# Altium project AMC_FMC_Carrier v4.PrjPcb (part 2 of 17)

## Sheet FPGA.SchDoc: AMC FMC Carrier v4
size 420 x 297 mm; Organization: WUT ISE; Address1: Warsaw University of Technology; Address2: Nowowiejska 15/19 00-665 Warsaw; Address3: t.przywozki@gmail.com; DocumentNumber: 1; SheetNumber: 3; SheetTotal: 29; ModifiedBy: M. Biernat; CheckedDate: -; Title2: FPGA Artix-7; DivGrp: ISE; Designer: T.Przywozki; Project: AMC FMC Carrier v4.0.2
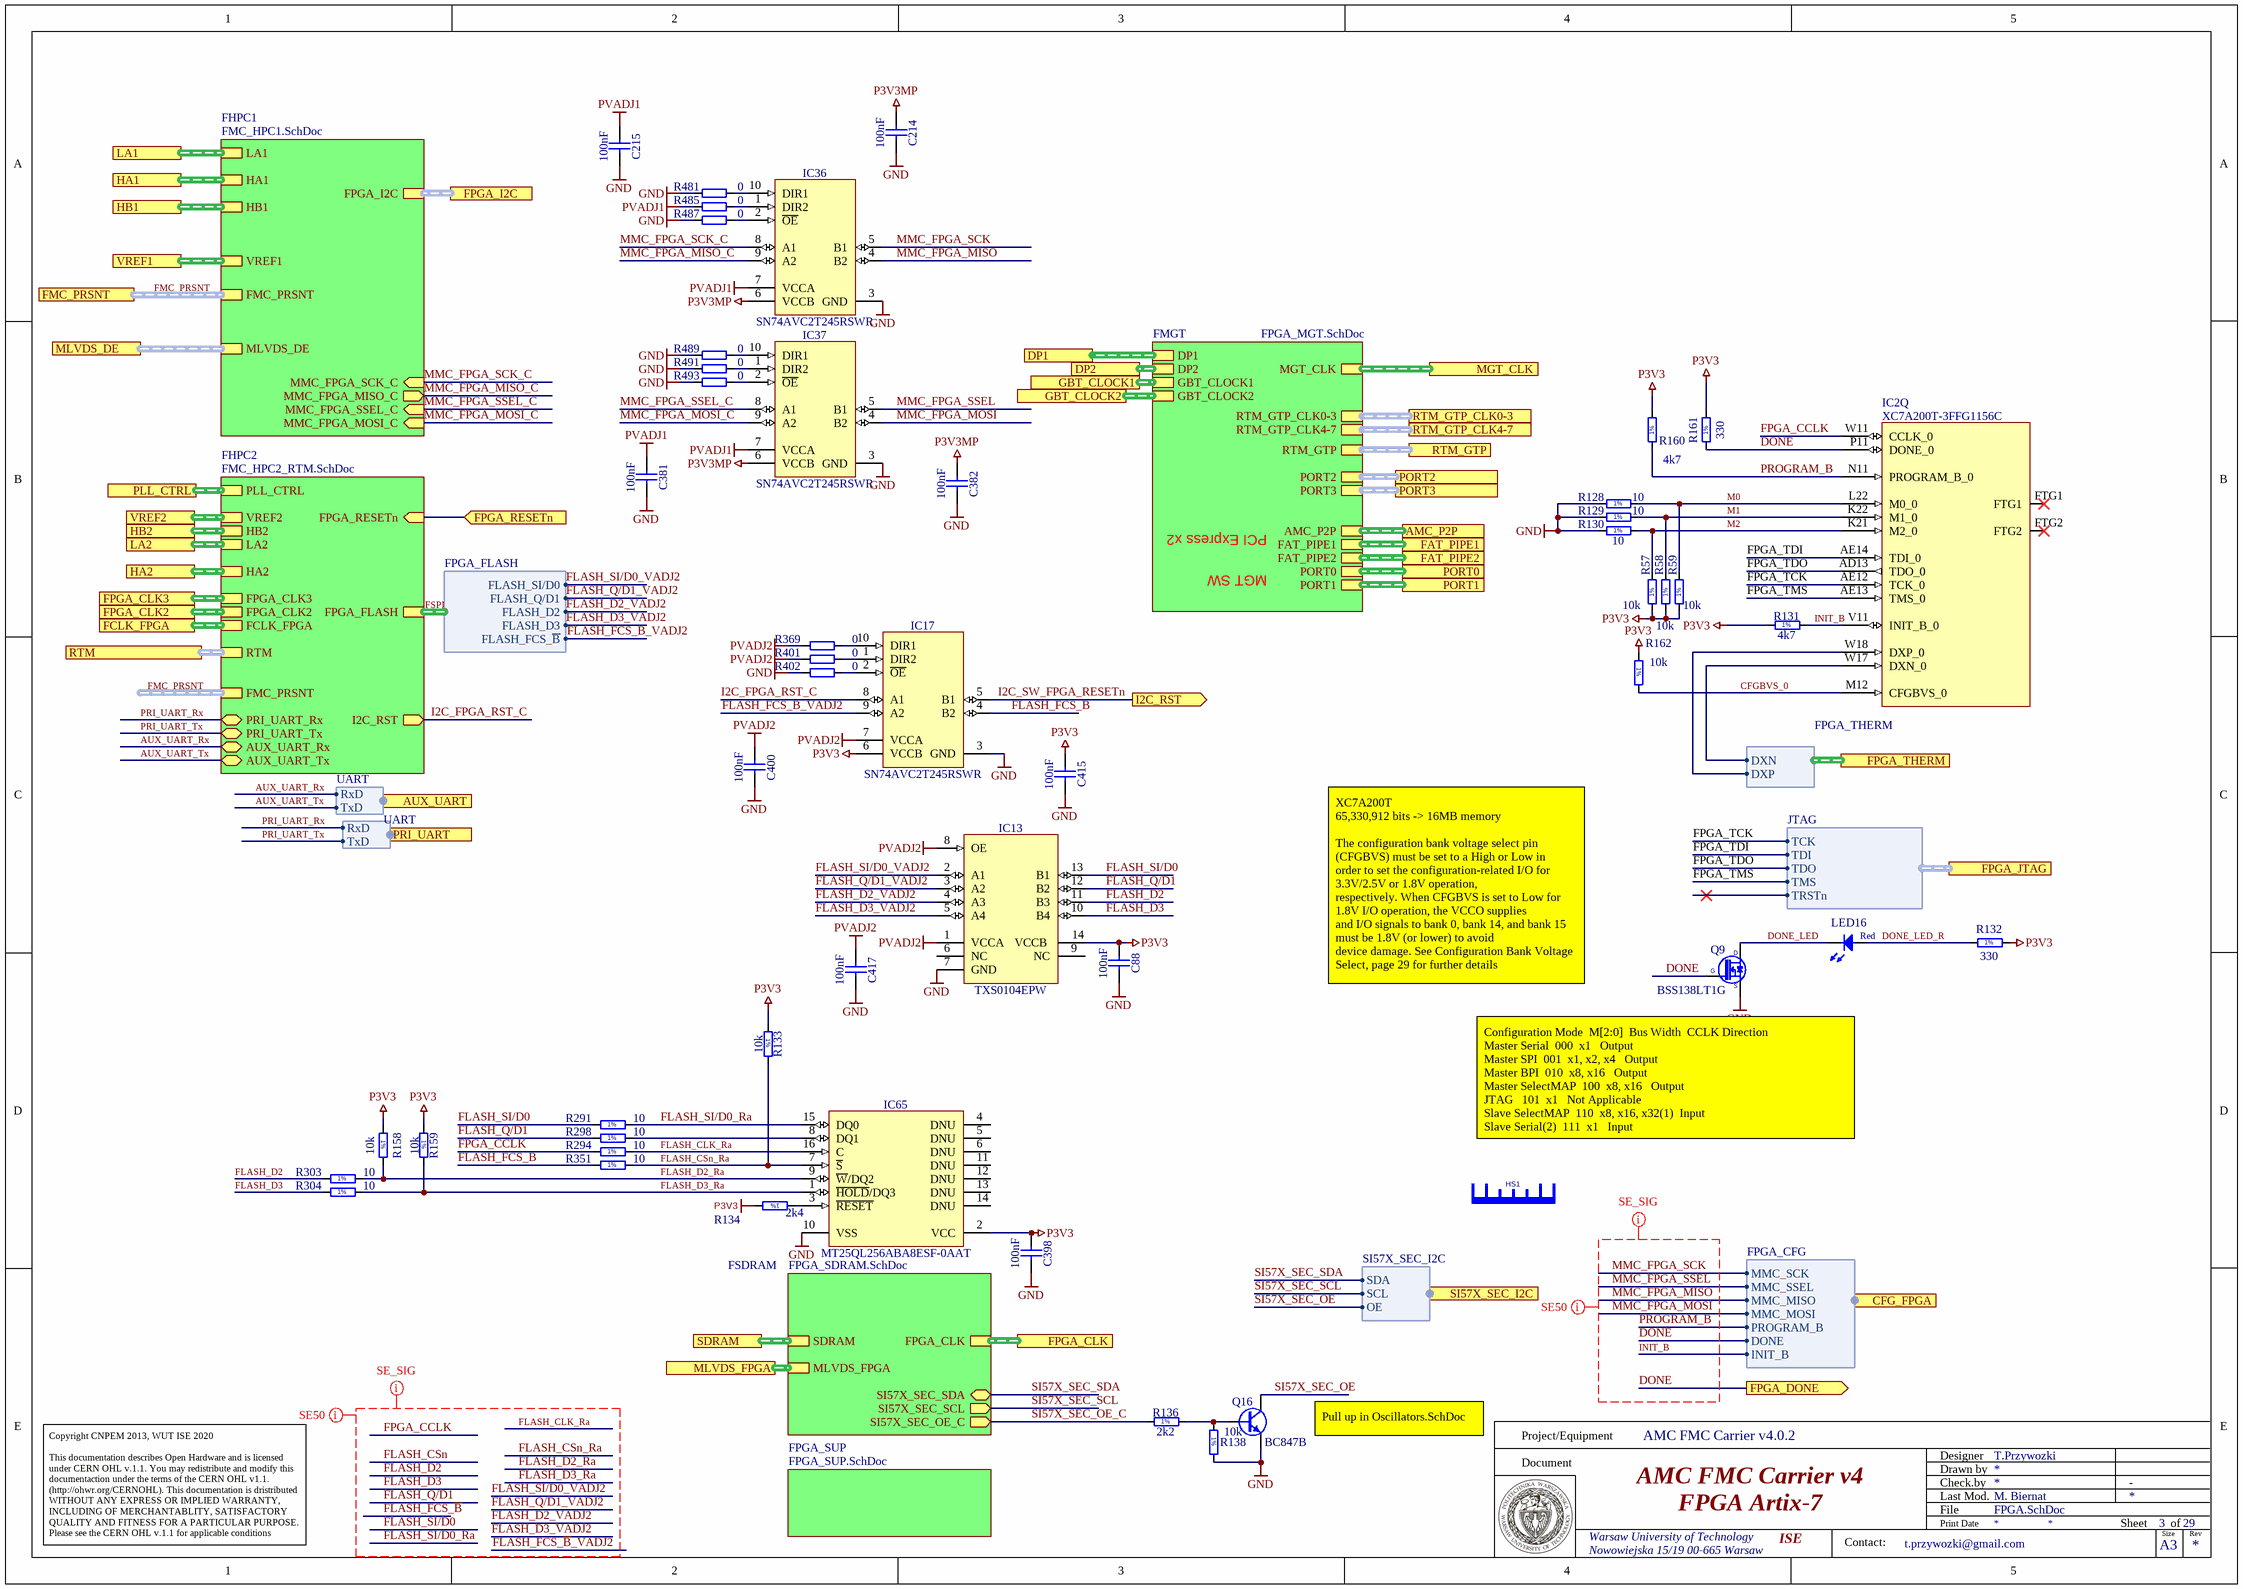
[diagram p3: FPGA.SchDoc]

### Parts
C88  100nF  [CAPC0603X33N]
C214  100nF  [CAPC0603X33N]
C215  100nF  [CAPC0603X33N]
C381  100nF  [CAPC0603X33N]
C382  100nF  [CAPC0603X33N]
C398  100nF  [CAPC0603X33N]
C400  100nF  [CAPC0603X33N]
C415  100nF  [CAPC0603X33N]
C417  100nF  [CAPC0603X33N]
HS1  Heat Sink No Pad  [HSINK_ATS_ATS-50350B-C1-R0]  (value not drawn)
IC2  XC7A200T-3FFG1156C  [BGA1156C100P34X34_3500X3500X335]  (part Q of 23)
IC13  TXS0104EPW  [SOP65P640X120-14N]
IC17  SN74AVC2T245RSWR  [QFN40P140X180X55-10N]
IC36  SN74AVC2T245RSWR  [QFN40P140X180X55-10N]
IC37  SN74AVC2T245RSWR  [QFN40P140X180X55-10N]
IC65  MT25QL256ABA8ESF-0AAT  [SOIC127P1030X265-16N]
LED16  Red  [LED_KINGBRIGHT_KPH-1608SURCK]
Q9  BSS138LT1G  [SOT95P240X110-3N]
Q16  BC847B  [SOT95P230X110-3N]
R57  10k  [RESC1005X40N]
R58  10k  [RESC1005X40N]
R59  10k  [RESC1005X40N]
R128  10  [RESC1005X40N]
R129  10  [RESC1005X40N]
R130  10  [RESC1005X40N]
R131  4k7  [RESC1005X40N]
R132  330  [RESC1005X40N]
R133  10k  [RESC1005X40N]
R134  2k4  [RESC1005X40N]
R136  2k2  [RESC1005X40N]
R138  10k  [RESC1005X40N]
R158  10k  [RESC1005X40N]
R159  10k  [RESC1005X40N]
R160  4k7  [RESC1005X40N]
R161  330  [RESC1005X40N]
R162  10k  [RESC1005X40N]
R291  10  [RESC1005X40N]
R294  10  [RESC1005X40N]
R298  10  [RESC1005X40N]
R303  10  [RESC1005X40N]
R304  10  [RESC1005X40N]
R351  10  [RESC1005X40N]
R369  0  [RESC0603X28N]
R401  0  [RESC0603X28N]
R402  0  [RESC0603X28N]
R481  0  [RESC1005X40N]
R485  0  [RESC1005X40N]
R487  0  [RESC1005X40N]
R489  0  [RESC1005X40N]
R491  0  [RESC1005X40N]
R493  0  [RESC1005X40N]

### Sub-sheets
FHPC1 = FMC_HPC1.SchDoc: LA1 (harness FMC_J1_LA), HA1 (harness FMC_J1_HA), HB1 (harness FMC_J1_HB), VREF1 (harness FMC_J1_VREF), FPGA_I2C (harness I2C), MMC_FPGA_SCK_C (in), MMC_FPGA_MISO_C (out), MMC_FPGA_SSEL_C (in), MMC_FPGA_MOSI_C (in), FMC_PRSNT (harness FMC_PRSNT), MLVDS_DE (harness MLVDS_DE)
FHPC2 = FMC_HPC2_RTM.SchDoc: VREF2 (harness FMC_J1_VREF), HB2 (harness FMC_J1_HB), LA2 (harness FMC_J1_LA), HA2 (harness FMC_J1_HA), FPGA_FLASH (harness FPGA_FLASH), PLL_CTRL (harness PLL_CTRL), FPGA_RESETn (in), RTM (harness RTM), AUX_UART_Rx (bidir), AUX_UART_Tx (bidir), PRI_UART_Rx (bidir), PRI_UART_Tx (bidir), I2C_RST (out), FPGA_CLK3 (harness FPGA_CLK), FPGA_CLK2 (harness FPGA_CLK), FMC_PRSNT (harness FMC_PRSNT), FCLK_FPGA (harness FPGA_CLK)
FMGT = FPGA_MGT.SchDoc: DP1 (harness FMC_J1_DP), DP2 (harness FMC_J1_DP), FAT_PIPE1 (harness FAT_PIPE1), FAT_PIPE2 (harness FAT_PIPE2), PORT0 (harness PORT0), PORT1 (harness PORT1), GBT_CLOCK1 (harness GBT_CLOCK), GBT_CLOCK2 (harness GBT_CLOCK), MGT_CLK (harness MGT_CLK), PORT2 (harness PORT2), PORT3 (harness PORT3), RTM_GTP (harness RTM_GTP), RTM_GTP_CLK0-3 (harness CLK_DIFF), RTM_GTP_CLK4-7 (harness CLK_DIFF), AMC_P2P (harness AMC_P2P)
FPGA_SUP = FPGA_SUP.SchDoc: no entries
FSDRAM = FPGA_SDRAM.SchDoc: SDRAM (harness DDR), MLVDS_FPGA (harness MLVDS-FPGA), FPGA_CLK (harness FPGA_SDRAM_CLK), SI57X_SEC_SDA (bidir), SI57X_SEC_OE_C (out), SI57X_SEC_SCL (out)

### Ports
AMC_P2P (harness AMC_P2P), AUX_UART (harness UART), CFG_FPGA (harness FPGA_CFG), DP1, DP2, FAT_PIPE1, FAT_PIPE2, FCLK_FPGA (harness FPGA_CLK), FMC_PRSNT (harness FMC_PRSNT), FPGA_CLK, FPGA_CLK2 (harness FPGA_CLK), FPGA_CLK3 (harness FPGA_CLK), FPGA_DONE (out), FPGA_I2C (harness I2C), FPGA_JTAG (harness JTAG), FPGA_RESETn (in), FPGA_THERM (harness FPGA_THERM), GBT_CLOCK1, GBT_CLOCK2, HA1, HA2, HB1, HB2, I2C_RST (out), LA1, LA2, MGT_CLK, MLVDS_DE (harness MLVDS_DE), MLVDS_FPGA (harness MLVDS-FPGA), PLL_CTRL (harness PLL_CTRL), PORT0 (harness PORT0), PORT1 (harness PORT1), PORT2 (harness PORT2), PORT3 (harness PORT3), PRI_UART (harness UART), RTM (harness RTM), RTM_GTP (harness RTM_GTP), RTM_GTP_CLK0-3 (harness CLK_DIFF), RTM_GTP_CLK4-7 (harness CLK_DIFF), SDRAM (harness DDR), SI57X_SEC_I2C (harness SI57X_SEC_I2C), VREF1 (harness FMC_J1_VREF), VREF2 (harness FMC_J1_VREF)

### Harnesses
JTAG: TCK, TDI, TDO, TMS, TRSTn
FPGA_THERM: DXN, DXP
FPGA_FLASH: FLASH_FCS_~{B}, FLASH_D3, FLASH_D2, FLASH_Q/D1, FLASH_SI/D0
UART: RxD, TxD
FPGA_CFG: MMC_MISO, MMC_MOSI, PROGRAM_B, DONE, INIT_B, MMC_SSEL, MMC_SCK
SI57X_SEC_I2C: SDA, SCL, OE

### Nets
GND: C88.2 C214.2 C215.2 C381.2 C382.2 C398.2 C400.2 C415.2 C417.2 IC13.7(GND) IC17.3(GND) IC36.3(GND) IC37.3(GND) IC65.10(VSS) Q9.2(S) Q16.2(E) R128.1 R129.1 R130.1 R138.2 R402.1 R481.1 R487.1 R489.1 R491.1 R493.1
P3V3: C88.1 C398.1 C415.1 IC13.14(VCCB) IC17.6(VCCB) IC65.2(VCC) R57.1 R58.1 R59.1 R131.1 R132.2 R133.1 R134.2 R158.1 R159.1 R160.2 R161.2 R162.1
P3V3MP: C214.1 C382.1 IC36.6(VCCB) IC37.6(VCCB)
PVADJ1: C215.1 C381.1 IC36.7(VCCA) IC37.7(VCCA) R485.1
PVADJ2: C400.1 C417.1 IC13.1(VCCA) IC13.8(OE) IC17.7(VCCA) R369.1 R401.1
AUX_UART_Rx: sheet FHPC2/AUX_UART_Rx, port AUX_UART.RxD
AUX_UART_Tx: sheet FHPC2/AUX_UART_Tx, port AUX_UART.TxD
CFGBVS_0: IC2.M12(CFGBVS_0) R162.2
DONE: IC2.P11(DONE_0) Q9.1(G) R161.1 ; port FPGA_DONE, port CFG_FPGA.DONE
DONE_LED: LED16.1(C) Q9.3(D)
DONE_LED_R: LED16.2(A) R132.1
FLASH_CLK_Ra: IC65.16(C) R294.2
FLASH_CSn_Ra: IC65.7(~{S}) R133.2 R351.2
FLASH_D2: IC13.11(B3) R303.1
FLASH_D2_Ra: IC65.9(~{W}/DQ2) R158.2 R303.2
FLASH_D2_VADJ2: IC13.4(A3) ; sheet FHPC2/FPGA_FLASH.FLASH_D2  [project net FSPI.FLASH_D2]
FLASH_D3: IC13.10(B4) R304.1
FLASH_D3_Ra: IC65.1(~{HOLD}/DQ3) R159.2 R304.2
FLASH_D3_VADJ2: IC13.5(A4) ; sheet FHPC2/FPGA_FLASH.FLASH_D3  [project net FSPI.FLASH_D3]
FLASH_FCS_~{B}: IC17.4(B2) R351.1
FLASH_FCS_~{B}_VADJ2: IC17.9(A2) ; sheet FHPC2/FPGA_FLASH.FLASH_FCS_~{B}  [project net FSPI.FLASH_FCS_~{B}]
FLASH_Q/D1: IC13.12(B2) R298.2
FLASH_Q/D1_VADJ2: IC13.3(A2) ; sheet FHPC2/FPGA_FLASH.FLASH_Q/D1  [project net FSPI.FLASH_Q/D1]
FLASH_SI/D0: IC13.13(B1) R291.1
FLASH_SI/D0_Ra: IC65.15(DQ0) R291.2
FLASH_SI/D0_VADJ2: IC13.2(A1) ; sheet FHPC2/FPGA_FLASH.FLASH_SI/D0  [project net FSPI.FLASH_SI/D0]
FPGA_CCLK: IC2.W11(CCLK_0) R294.1
FPGA_RESETn: port FPGA_RESETn, sheet FHPC2/FPGA_RESETn
FPGA_TCK: IC2.AE12(TCK_0) ; port FPGA_JTAG.TCK  [project net FJTAG.TCK]
FPGA_TDI: IC2.AE14(TDI_0) ; port FPGA_JTAG.TDI  [project net FJTAG.TDI]
FPGA_TDO: IC2.AD13(TDO_0) ; port FPGA_JTAG.TDO  [project net FJTAG.TDO]
FPGA_TMS: IC2.AE13(TMS_0) ; port FPGA_JTAG.TMS  [project net FJTAG.TMS]
I2C_FPGA_RST_C: IC17.8(A1) ; sheet FHPC2/I2C_RST
I2C_SW_FPGA_RESETn: IC17.5(B1) ; port I2C_RST  [project net FPGA_I2C_RST]
INIT_B: IC2.V11(INIT_B_0) R131.2 ; port CFG_FPGA.INIT_B
M0: IC2.L22(M0_0) R59.2 R128.2
M1: IC2.K22(M1_0) R58.2 R129.2
M2: IC2.K21(M2_0) R57.2 R130.2
MMC_FPGA_MISO: IC36.4(B2) ; port CFG_FPGA.MMC_MISO
MMC_FPGA_MISO_C: IC36.9(A2) ; sheet FHPC1/MMC_FPGA_MISO_C
MMC_FPGA_MOSI: IC37.4(B2) ; port CFG_FPGA.MMC_MOSI
MMC_FPGA_MOSI_C: IC37.9(A2) ; sheet FHPC1/MMC_FPGA_MOSI_C
MMC_FPGA_SCK: IC36.5(B1) ; port CFG_FPGA.MMC_SCK
MMC_FPGA_SCK_C: IC36.8(A1) ; sheet FHPC1/MMC_FPGA_SCK_C
MMC_FPGA_SSEL: IC37.5(B1) ; port CFG_FPGA.MMC_SSEL
MMC_FPGA_SSEL_C: IC37.8(A1) ; sheet FHPC1/MMC_FPGA_SSEL_C
PRI_UART_Rx: sheet FHPC2/PRI_UART_Rx, port PRI_UART.RxD
PRI_UART_Tx: sheet FHPC2/PRI_UART_Tx, port PRI_UART.TxD
PROGRAM_B: IC2.N11(PROGRAM_B_0) R160.1 ; port CFG_FPGA.PROGRAM_B
SI57X_SEC_OE: Q16.3(C) ; port SI57X_SEC_I2C.OE
SI57X_SEC_OE_C: R136.1 ; sheet FSDRAM/SI57X_SEC_OE_C
SI57X_SEC_SCL: sheet FSDRAM/SI57X_SEC_SCL, port SI57X_SEC_I2C.SCL
SI57X_SEC_SDA: sheet FSDRAM/SI57X_SEC_SDA, port SI57X_SEC_I2C.SDA
NetIC2_W17: IC2.W17(DXN_0) ; port FPGA_THERM.DXN
NetIC2_W18: IC2.W18(DXP_0) ; port FPGA_THERM.DXP
NetIC17_1: IC17.1(DIR2) R401.2
NetIC17_2: IC17.2(~{OE}) R402.2
NetIC17_10: IC17.10(DIR1) R369.2
NetIC36_1: IC36.1(DIR2) R485.2
NetIC36_2: IC36.2(~{OE}) R487.2
NetIC36_10: IC36.10(DIR1) R481.2
NetIC37_1: IC37.1(DIR2) R491.2
NetIC37_2: IC37.2(~{OE}) R493.2
NetIC37_10: IC37.10(DIR1) R489.2
NetIC65_3: IC65.3(~{RESET}) R134.1
NetIC65_8: IC65.8(DQ1) R298.1
NetQ16_1: Q16.1(B) R136.2 R138.1

Not connected (* = marked no-connect by the designer): IC2 FTG1* FTG2*; IC13 6(NC) 9(NC); IC65 4(DNU) 5(DNU) 6(DNU) 11(DNU) 12(DNU) 13(DNU) 14(DNU)

### Buses and harness runs
harness FMC_PRSNT = port FMC_PRSNT = sheet FHPC1/FMC_PRSNT
harness FMC_PRSNT = sheet FHPC2/FMC_PRSNT
harness FSPI = sheet FHPC2/FPGA_FLASH
harness port AMC_P2P = sheet FMGT/AMC_P2P
harness port DP1 = sheet FMGT/DP1
harness port DP2 = sheet FMGT/DP2
harness port FAT_PIPE1 = sheet FMGT/FAT_PIPE1
harness port FAT_PIPE2 = sheet FMGT/FAT_PIPE2
harness port FCLK_FPGA = sheet FHPC2/FCLK_FPGA
harness port FPGA_CLK2 = sheet FHPC2/FPGA_CLK2
harness port FPGA_CLK3 = sheet FHPC2/FPGA_CLK3
harness port FPGA_CLK = sheet FSDRAM/FPGA_CLK
harness port FPGA_I2C = sheet FHPC1/FPGA_I2C
harness port GBT_CLOCK1 = sheet FMGT/GBT_CLOCK1
harness port GBT_CLOCK2 = sheet FMGT/GBT_CLOCK2
harness port HA1 = sheet FHPC1/HA1
harness port HA2 = sheet FHPC2/HA2
harness port HB1 = sheet FHPC1/HB1
harness port HB2 = sheet FHPC2/HB2
harness port LA1 = sheet FHPC1/LA1
harness port LA2 = sheet FHPC2/LA2
harness port MGT_CLK = sheet FMGT/MGT_CLK
harness port MLVDS_DE = sheet FHPC1/MLVDS_DE
harness port MLVDS_FPGA = sheet FSDRAM/MLVDS_FPGA
harness port PLL_CTRL = sheet FHPC2/PLL_CTRL
harness port PORT0 = sheet FMGT/PORT0
harness port PORT1 = sheet FMGT/PORT1
harness port PORT2 = sheet FMGT/PORT2
harness port PORT3 = sheet FMGT/PORT3
harness port RTM = sheet FHPC2/RTM
harness port RTM_GTP = sheet FMGT/RTM_GTP
harness port RTM_GTP_CLK0-3 = sheet FMGT/RTM_GTP_CLK0-3
harness port RTM_GTP_CLK4-7 = sheet FMGT/RTM_GTP_CLK4-7
harness port SDRAM = sheet FSDRAM/SDRAM
harness port VREF1 = sheet FHPC1/VREF1
harness port VREF2 = sheet FHPC2/VREF2

### Layout directives
net class SE50: DONE, FLASH_CLK_Ra, FLASH_CSn, FLASH_CSn_Ra, FLASH_D2, FLASH_D2_Ra, FLASH_D2_VADJ2, FLASH_D3, FLASH_D3_Ra, FLASH_D3_VADJ2, FLASH_FCS_~{B}, FLASH_FCS_~{B}_VADJ2, FLASH_Q/D1, FLASH_Q/D1_VADJ2, FLASH_SI/D0, FLASH_SI/D0_Ra, FLASH_SI/D0_VADJ2, FPGA_CCLK, INIT_B, MMC_FPGA_MISO, MMC_FPGA_MOSI, MMC_FPGA_SCK, MMC_FPGA_SSEL, PROGRAM_B
net class SE_SIG: DONE, FLASH_CLK_Ra, FLASH_CSn, FLASH_CSn_Ra, FLASH_D2, FLASH_D2_Ra, FLASH_D2_VADJ2, FLASH_D3, FLASH_D3_Ra, FLASH_D3_VADJ2, FLASH_FCS_~{B}, FLASH_FCS_~{B}_VADJ2, FLASH_Q/D1, FLASH_Q/D1_VADJ2, FLASH_SI/D0, FLASH_SI/D0_Ra, FLASH_SI/D0_VADJ2, FPGA_CCLK, INIT_B, MMC_FPGA_MISO, MMC_FPGA_MOSI, MMC_FPGA_SCK, MMC_FPGA_SSEL, PROGRAM_B

### Notes on the sheet
- PCI Express x2
- MGT SW
- XC7A200T
  65,330,912 bits -> 16MB memory
  The configuration bank voltage select pin (CFGBVS) must be set to a High or Low in
  order to set the configuration-related I/O for 3.3V/2.5V or 1.8V operation,
  respectively. When CFGBVS is set to Low for 1.8V I/O operation, the VCCO supplies
  and I/O signals to bank 0, bank 14, and bank 15 must be 1.8V (or lower) to avoid
  device damage. See Configuration Bank Voltage Select, page 29 for further details
- (near Q9) Configuration Mode 	M[2:0] 	Bus Width 	CCLK Direction
  Master Serial 	000 	x1 		Output
  Master SPI 	001 	x1, x2, x4 		Output
  Master BPI 	010 	x8, x16 		Output
  Master SelectMAP 	100 	x8, x16 		Output
  JTAG 		101 	x1 		Not Applicable
  Slave SelectMAP 	110	 x8, x16, x32(1) 	Input
  Slave Serial(2) 	111 	x1 		Input
- Pull up in Oscillators.SchDoc
- Project/Equipment
- Document
- Designer
- Drawn by
- Check.by
- Copyright CNPEM 2013, WUT ISE 2020
  This documentation describes Open Hardware and is licensed under CERN OHL v.1.1. You may redistribute and modify this documentaction under the terms of the CERN OHL v1.1.
  (http://ohwr.org/CERNOHL). This documentation is dristributed WITHOUT ANY EXPRESS OR IMPLIED WARRANTY, INCLUDING OF MERCHANTABLITY, SATISFACTORY QUALITY AND FITNESS FOR A PARTICULAR PURPOSE. Please see the CERN OHL v.1.1 for applicable conditions
- File
- Last Mod.
- Print Date
- Sheet
- Size
- A3
- of
- Rev
- Contact:
- (in symbol R0402_2K2_1%_0.0625W_100PPM) 1%
- (in symbol R0402_2K4_1%_0.0625W_100PPM) 1%
- (in symbol R0402_4K7_1%_0.0625W_100PPM) 1%
- (in symbol R0402_10K_1%_0.0625W_100PPM) 1%
- (in symbol R0402_10R_1%_0.0625W_200PPM) 1%
- (in symbol R0402_330R_1%_0.0625W_100PPM) 1%
- (in symbol R0402_0R_JUMPER) 1%

### Library data of the parts
C88 C214 C215 C381 C382 C398 C400 C415 C417 = CC0201_100NF_6.3V_10%_X5R: Non-polarised capacitor; Part Description: SMD Multilayer Chip Ceramic Capacitor; Manufacturer: GENERIC; Manufacturer1 Part Number: 02016D104KAT2A; Voltage: 6.3V; TC: X5R; Tolerance: ±10%; Table: Capacitors SMD; Part Number: CC0201_100NF_6.3V_10%_X5R; Component Kind: Standard; Component Type: Standard; Pin Count: 2; Value: 100nF; Status: Not Recommended; Manufacturer Part Number: CC0201_100NF_6.3V_10%_X5R; Case: 0201; Mounted: Yes; Socket: No; SMD: Yes; Manufacturer1 Example: AVX; Manufacturer1 ComponentHeight: 0.33mm; HelpURL: \\cern.ch\dfs\Applications\Altium\Datasheets\CC0201_X5R_AVX.pdf; Author: CERN DEM JLC; CreateDate: 2007-12-03; LatestRevisionDate: 2007-12-03
HS1 = HSINK_ATS_ATS-50350B-C1-R0: Heat Sink Without Pad; Part Description: 35.0 x 35.0 x 7.5 mm BGA Heat Sink, High Performance maxiFLOW/maxiGRIP-STD; Manufacturer: ADVENCED THERMAL SOLUTION (ATS); PressFit: No; Part Number: HSINK_ATS_ATS-50350B-C1-R0; Component Kind: Accessories; Component Type: Standard; Pin Count: 0; PackageDescription: 35.0 x 35.0 x 7.5 mm BGA Heat Sink, Body 49.9mm x 35mm  Height 7.5mm; Mounted: Yes; Socket: No; SMD: No; Sense: No; Status: None; Manufacturer Part Number: ATS-50350B-C1-R0; ComponentHeight: 7.5mm; HelpURL: \\cern.ch\dfs\Applications\Altium\Datasheets\HSINK_ATS_ATS-50350B-C1-R0.pdf; Author: CERN DEM JLC; CreateDate: 30.11.2016; LatestRevisionDate: 30.11.2016
IC2 = XC7A200T-3FFG1156C: Artix-6 FPGA, 16 GTPs, 600 User I/Os, 1156-Pin BGA, Speed Grade 2, Commercial Grade, Pb-Free; Part Description: Artix-7 FPGA, 16 GTPs, 600 User I/Os, 1156-Pin BGA, Speed Grade 2, Commercial Grade, Pb-Free; Manufacturer: XILINX; Manufacturer Part Number: XC7A350T-2FFG1156C; Table: Logic; Part Number: XC7A200T-3FFG1156C; Component Kind: Standard; Component Type: Standard; Device: XC7A200T-3FFG1156C; PackageDescription: BGA, 1.00mm Pitch, Square; 1156 Pin, 34 Columns X 34 Rows, 35.00mm X 35.00mm X 3.350mm H; Pin Count: 1156; Case: BGA1156; Mounted: Yes; Socket: No; SMD: Yes; ComponentHeight: 3.35mm; HelpURL: \\cern.ch\dfs\Applications\Altium\Datasheets\XC7A350T-2FFG1156C.pdf; ComponentLink1URL: \\cern.ch\dfs\Applications\Altium\Datasheets\XC7A350T-2FFG1156C.pdf; ComponentLink1Description: Package/Pinout; Author: CERN DEM JLC; CreateDate: 2012-09-19; LatestRevisionDate: 2012-09-19
IC13 = TXS0104EPW: 4-Bit Bidirectional Voltage-Level Translator For Open-Drain And Push-Pull Applications; Manufacturer: TEXAS INSTRUMENTS; PressFit: No; Bonding: No; Part Number: TXS0104EPW; Component Kind: Standard; Component Type: Standard; Device: TXS0104EPW; PackageDescription: SOP, 0.65mm Pitch; 14 Pin, 5.00mm W X 4.40mm L X 1.20mm H body, IPC Medium Density; Part Description: 4-Bit Bidirectional Voltage-Level Translator For Open-Drain And Push-Pull Applications; Manufacturer Part Number: TXS0104EPW; Pin Count: 14; Case: TSSOP14; Mounted: Yes; Socket: No; SMD: Yes; Sense: No; ComponentHeight: 1.2mm; Author: CERN DEM MR; HelpURL: \\cern.ch\dfs\Applications\Altium\Datasheets\TXS0104EPW.pdf; CreateDate: 07.10.2016; LatestRevisionDate: 07.10.2016
IC17 IC36 IC37 = SN74AVC2T245RSWR: Dual-Bit Dual-Supply Bus Transceiver With Configurable Voltage Translation and 3-State Outputs; Manufacturer: TEXAS INSTRUMENTS; PressFit: No; Bonding: No; Manufacturer Part Number: SN74AVC2T245RSWR; PackageDescription: QFN, 0.40mm Pitch, Rect.;10 Pin, 1.80mm L X 1.40mm W X 0.55mm H Body, IPC Medium Density; Part Description: Dual-Bit Dual-Supply Bus Transceiver With Configurable Voltage Translation and 3-State Outputs; Part Number: SN74AVC2T245RSWR; Component Kind: Standard; Component Type: Standard; Device: SN74AVC2T245RSWR; Status: Not Recommended; Pin Count: 10; Case: QFN10; Mounted: Yes; Socket: No; SMD: Yes; Sense: No; ComponentHeight: 0.55mm; Author: CERN DEM JLC; HelpURL: \\cern.ch\dfs\Applications\Altium\Datasheets\SN74AVC2T245RSWR.pdf; CreateDate: 07.07.2014; LatestRevisionDate: 30.03.2017
IC65 = MT25QL256ABA8ESF-0AAT: 256Mbit (32MB), 2.7V-3.6V, Multiple I/O Serial NOR Flash Memory,with Reset# & Hold#; Part Description: 256Mbit (32MB), 2.7V-3.6V, Multiple I/O Serial NOR Flash Memory,with Reset# & Hold# (Automotive grade AEC-Q100); Manufacturer: MICRON TECHNOLOGY; PressFit: No; Bonding: No; Part Number: MT25QL256ABA8ESF-0AAT; Component Kind: Standard; Component Type: Standard; Device: MT25QL256ABA8ESF-0AAT; PackageDescription: SOIC 16, Pitch 1.27mm - Body 7.5x10.3mm, IPC Medium Density; Manufacturer Part Number: MT25QL256ABA8ESF-0AAT; Pin Count: 16; Case: SOIC16; Mounted: Yes; Socket: No; SMD: Yes; Sense: No; ComponentHeight: 2.65mm; HelpURL: \\cern.ch\dfs\Applications\Altium\Datasheets\MT25QL256ABA8ESF-0AAT.pdf; Author: CERN DEM JLC; CreateDate: 05.11.2018; LatestRevisionDate: 05.11.2018
LED16 = LED_KINGBRIGHT_KPH-1608SURCK: LED Red 1C 2A; Part Description: SMD Hyper Red LED, Case 1.6mmX0.8mm(0603), 0.65mm Thickness; PressFit: No; Bonding: No; Part Number: LED_KINGBRIGHT_KPH-1608SURCK; Component Kind: Standard; Component Type: Standard; Color: Red; PackageDescription: SMT Hyper Red LED, Case 0603, Body L 1.6 x W 0.8mm H 0.65mm; Manufacturer: KINGBRIGHT; Manufacturer Part Number: KPH-1608SURCK; Pin Count: 2; Mounted: Yes; Socket: No; SMD: Yes; Sense: No; ComponentHeight: 0.65mm; HelpURL: \\cern.ch\dfs\Applications\Altium\Datasheets\LED_KINGBRIGHT_KPH-1608SURCK.pdf; Author: CERN DEM JLC; CreateDate: 03.07.2017; LatestRevisionDate: 03.07.2017
Q9 = BSS138LT1G: N-CHANNEL MOSFET WITH DIODE; Part Description: 50V 200mA N-Channel Enhancement Mode Field-Effect Transistor; Manufacturer: ON SEMICONDUCTOR; PressFit: No; Bonding: No; Part Number: BSS138LT1G; Component Kind: Standard; Component Type: Standard; Device: BSS138LT1G; PackageDescription: SOT23 3-Leads, Pitch 0.95mm - Body 1.4x3mm, IPC Medium Density; Manufacturer Part Number: BSS138LT1G; Pin Count: 3; Case: SOT23-3; Mounted: Yes; Socket: No; SMD: Yes; Sense: No; ComponentHeight: 1.11mm; HelpURL: \\cern.ch\dfs\Applications\Altium\Datasheets\BSS138LT1G.pdf; Author: CERN DEM JLC; CreateDate: 23.03.2009; LatestRevisionDate: 23.03.2009
Q16 = BC847B: NPN Transistor; Part Description: 45V 100mA NPN general-purpose transistors; Manufacturer: NXP SEMICONDUCTORS; PressFit: No; Bonding: No; Part Number: BC847B; Component Kind: Standard; Component Type: Standard; Device: BC847B; PackageDescription: SOT23, 3 pin, Pitch 0.95mm - 1.3mm W X 2.9mm L X 1.1mm H, IPC Medium Density; Manufacturer Part Number: BC847B; Pin Count: 3; Case: SOT23-3; Mounted: Yes; Socket: No; SMD: Yes; Sense: No; ComponentHeight: 1.1mm; HelpURL: \\cern.ch\dfs\Applications\Altium\Datasheets\BC847B.pdf; Author: CERN DEM JLC; CreateDate: 14.06.2011; LatestRevisionDate: 14.06.2011
R57-R59 R133 R138 R158 R159 R162 = R0402_10K_1%_0.0625W_100PPM: Resistor - 1%; Part Description: General Purpose Thick Film Chip Resistor; Manufacturer: GENERIC; Manufacturer1 Part Number: 232270671003L; TC: ±100ppm/°C; Table: Resistors SMD; Part Number: R0402_10K_1%_0.0625W_100PPM; Component Kind: Standard; Component Type: Standard; Pin Count: 2; Value: 10k; Status: Not recommended; Power: 0.0625W; Tolerance: ±1%; Manufacturer Part Number: R0402_10K_1%_0.0625W_100PPM; Case: 0402; Mounted: Yes; Socket: No; SMD: Yes; Manufacturer1 Example: YAGEO PHYCOMP; Manufacturer1 ComponentHeight: 0.4mm; HelpURL: \\cern.ch\dfs\Applications\Altium\Datasheets\R0402_Phycomp_RC0402.pdf; Author: CERN DEM JLC; CreateDate: 2007-12-03; LatestRevisionDate: 2012-10-17
R128-R130 R291 R294 R298 R303 R304 R351 = R0402_10R_1%_0.0625W_200PPM: Resistor - 1%; Part Description: General Purpose Thick Film Chip Resistor; Manufacturer: GENERIC; Manufacturer1 Part Number: 232270671009L; TC: ±200ppm/°C; Table: Resistors SMD; Part Number: R0402_10R_1%_0.0625W_200PPM; Component Kind: Standard; Component Type: Standard; Pin Count: 2; Value: 10; Status: Not recommended; Power: 0.0625W; Tolerance: ±1%; Manufacturer Part Number: R0402_10R_1%_0.0625W_200PPM; Case: 0402; Mounted: Yes; Socket: No; SMD: Yes; Manufacturer1 Example: YAGEO PHYCOMP; Manufacturer1 ComponentHeight: 0.4mm; HelpURL: \\cern.ch\dfs\Applications\Altium\Datasheets\R0402_Phycomp_RC0402.pdf; Author: CERN DEM JLC; CreateDate: 2009-06-24; LatestRevisionDate: 2012-10-17
R131 R160 = R0402_4K7_1%_0.0625W_100PPM: Resistor - 1%; Part Description: General Purpose Thick Film Chip Resistor; Manufacturer: GENERIC; Manufacturer1 Part Number: 232270674702L; TC: ±100ppm/°C; Table: Resistors SMD; Part Number: R0402_4K7_1%_0.0625W_100PPM; Component Kind: Standard; Component Type: Standard; Pin Count: 2; Value: 4k7; Status: Not recommended; Power: 0.0625W; Tolerance: ±1%; Manufacturer Part Number: R0402_4K7_1%_0.0625W_100PPM; Case: 0402; Mounted: Yes; Socket: No; SMD: Yes; Manufacturer1 Example: YAGEO PHYCOMP; Manufacturer1 ComponentHeight: 0.4mm; HelpURL: \\cern.ch\dfs\Applications\Altium\Datasheets\R0402_Phycomp_RC0402.pdf; Author: CERN DEM JLC; CreateDate: 2007-12-03; LatestRevisionDate: 2012-10-17
R132 R161 = R0402_330R_1%_0.0625W_100PPM: Resistor - 1%; Part Description: General Purpose Thick Film Chip Resistor; Manufacturer: GENERIC; Manufacturer1 Part Number: 232270673301L; TC: ±100ppm/°C; Table: Resistors SMD; Part Number: R0402_330R_1%_0.0625W_100PPM; Component Kind: Standard; Component Type: Standard; Pin Count: 2; Value: 330; Status: Not recommended; Power: 0.0625W; Tolerance: ±1%; Manufacturer Part Number: R0402_330R_1%_0.0625W_100PPM; Case: 0402; Mounted: Yes; Socket: No; SMD: Yes; Manufacturer1 Example: YAGEO PHYCOMP; Manufacturer1 ComponentHeight: 0.4mm; HelpURL: \\cern.ch\dfs\Applications\Altium\Datasheets\R0402_Phycomp_RC0402.pdf; Author: CERN DEM JLC; CreateDate: 2007-12-03; LatestRevisionDate: 2012-10-17
R134 = R0402_2K4_1%_0.0625W_100PPM: Resistor - 1%; Manufacturer: GENERIC; Part Description: General Purpose Thick Film Chip Resistor; Manufacturer1 Part Number: 232270672402L; TC: ±100ppm/°C; PressFit: No; Manufacturer Part Number: R0402_2K4_1%_0.0625W_100PPM; Part Number: R0402_2K4_1%_0.0625W_100PPM; Tolerance: ±1%; Value: 2k4; Component Kind: Standard; Component Type: Standard; Pin Count: 2; Status: Not Recommended; Power: 0.0625W; Case: 0402; Mounted: Yes; Sense: No; Socket: No; SMD: Yes; Manufacturer1 Example: YAGEO PHYCOMP; Manufacturer1 ComponentHeight: 0.4mm; HelpURL: \\cern.ch\dfs\Applications\Altium\Datasheets\R0402_Phycomp_RC0402.pdf; Author: CERN DEM JLC; CreateDate: 03.12.2007; LatestRevisionDate: 17.10.2012
R136 = R0402_2K2_1%_0.0625W_100PPM: Resistor - 1%; Part Description: General Purpose Thick Film Chip Resistor; Manufacturer: GENERIC; Manufacturer1 Part Number: 232270672202L; TC: ±100ppm/°C; Table: Resistors SMD; Part Number: R0402_2K2_1%_0.0625W_100PPM; Component Kind: Standard; Component Type: Standard; Pin Count: 2; Value: 2k2; Status: Not recommended; Power: 0.0625W; Tolerance: ±1%; Manufacturer Part Number: R0402_2K2_1%_0.0625W_100PPM; Case: 0402; Mounted: Yes; Socket: No; SMD: Yes; Manufacturer1 Example: YAGEO PHYCOMP; Manufacturer1 ComponentHeight: 0.4mm; HelpURL: \\cern.ch\dfs\Applications\Altium\Datasheets\R0402_Phycomp_RC0402.pdf; Author: CERN DEM JLC; CreateDate: 2007-12-03; LatestRevisionDate: 2012-10-17
R369 R401 R402 = R0201_0R_JUMPER: Resistor; Part Description: 1A (0.05R Max DC Resistance) Zero Ohm Jumper; Manufacturer: GENERIC; Manufacturer1 Part Number: CRCW02010000Z0ED; PressFit: No; Part Number: R0201_0R_JUMPER; Component Kind: Standard; Component Type: Standard; Pin Count: 2; Value: 0; Status: Not Recommended; Manufacturer Part Number: R0201_0R_JUMPER; Case: 0201; Mounted: Yes; Sense: No; Socket: No; SMD: Yes; Manufacturer1 Example: VISHAY; Manufacturer1 ComponentHeight: 0.27mm; HelpURL: \\cern.ch\dfs\Applications\Altium\Datasheets\R0201_VISHAY_CRCW e3.pdf; Author: CERN DEM JLC; CreateDate: 19.11.2014; LatestRevisionDate: 08.01.2015
R481 R485 R487 R489 R491 R493 = R0402_0R_JUMPER: Resistor; Manufacturer: GENERIC; Part Description: 1A (0.05R Max DC Resistance) Zero Ohm Jumper; Manufacturer1 Part Number: 232270591001L; PressFit: No; Manufacturer Part Number: R0402_0R_JUMPER; Part Number: R0402_0R_JUMPER; Value: 0; Component Kind: Standard; Component Type: Standard; Pin Count: 2; Status: Not Recommended; Case: 0402; Mounted: Yes; Sense: No; Socket: No; SMD: Yes; Manufacturer1 Example: YAGEO PHYCOMP; Manufacturer1 ComponentHeight: 0.4mm; HelpURL: \\cern.ch\dfs\Applications\Altium\Datasheets\R0402_Phycomp_RC0402.pdf; Author: CERN DEM JLC; CreateDate: 03.12.2007; LatestRevisionDate: 17.10.2012

## Sheet FPGA_SDRAM.SchDoc: AMC FMC Carrier v4
size 420 x 297 mm; CompanyName: WUT; Organization: WUT ISE; Address1: Warsaw University of Technology; Address2: Nowowiejska 15/19 00-665 Warsaw; Address3: t.przywozki@gmail.com; Revision: 1; SheetNumber: 6; SheetTotal: 29; Project: AMC FMC Carrier v4.0.2; ModifiedBy: F. Świtakowski; CheckedDate: -; Title2: FPGA banks 32 & 33 (SDRAM); DivGrp: ISE; Designer: T. Przywozki; ModifiedDate: -; ProjectName: ADC/DAC MEZZANINE
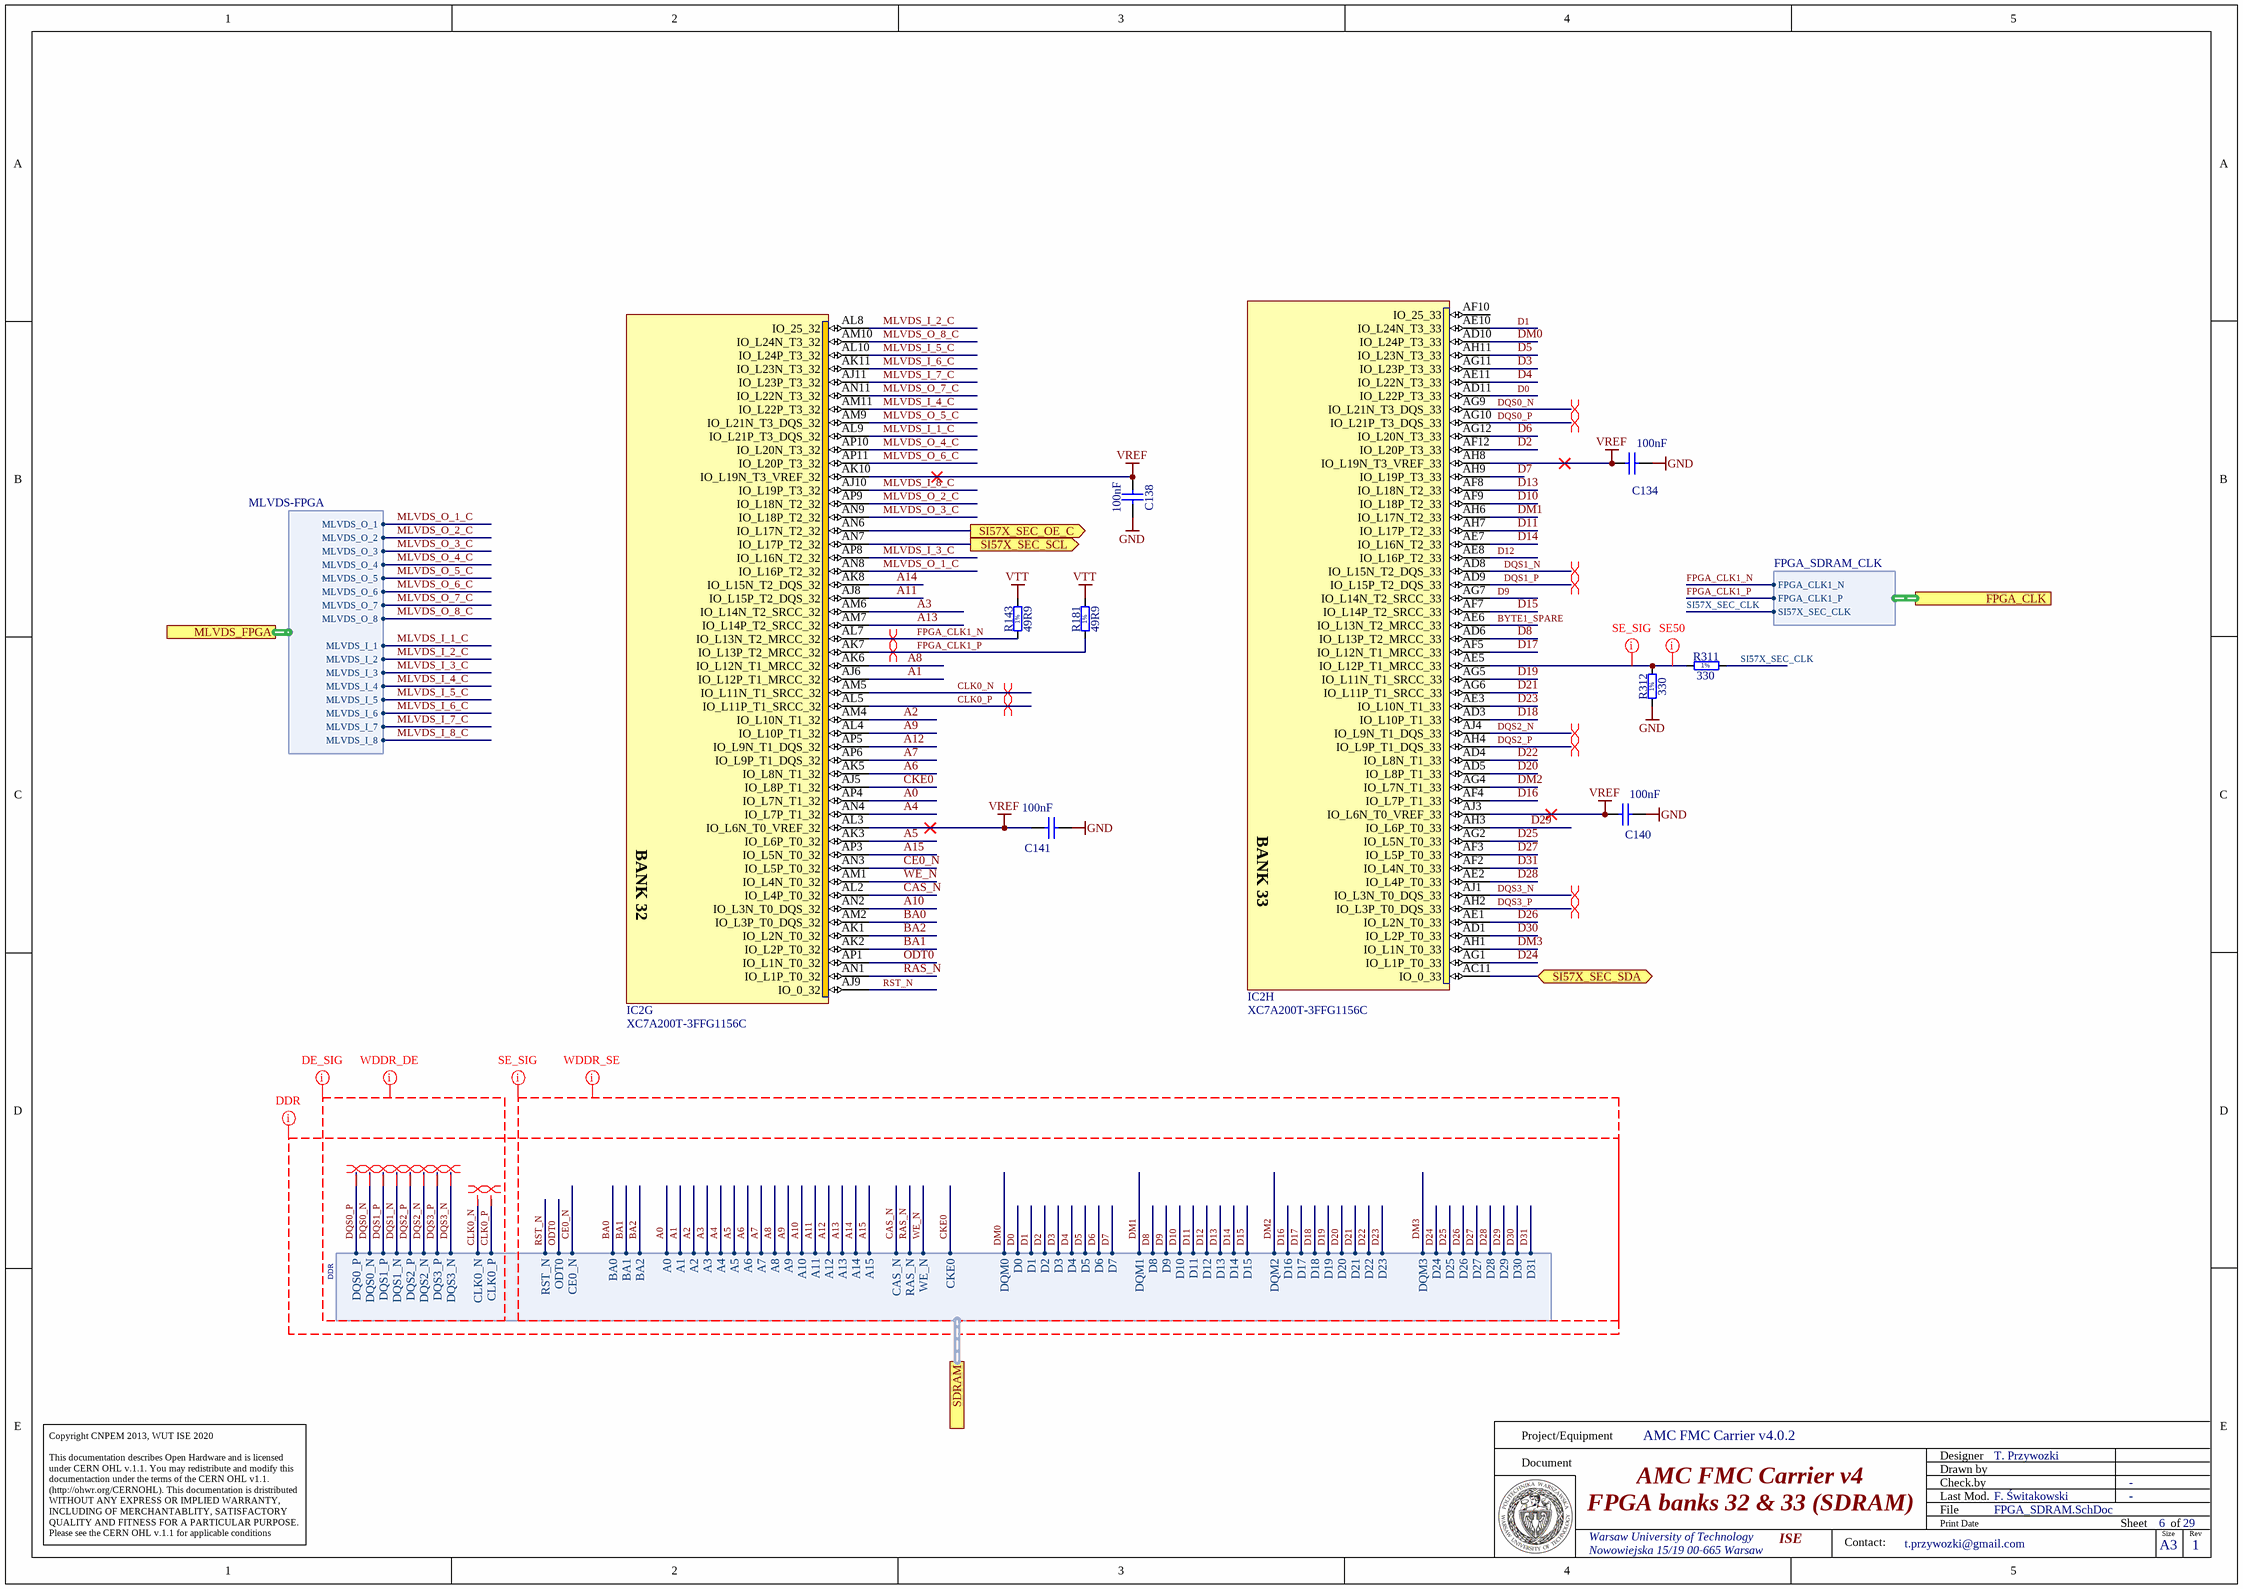
[diagram p4: FPGA_SDRAM.SchDoc]

### Parts
C134  100nF  [CAPC0603X33N]
C138  100nF  [CAPC0603X33N]
C140  100nF  [CAPC0603X33N]
C141  100nF  [CAPC0603X33N]
IC2  XC7A200T-3FFG1156C  [BGA1156C100P34X34_3500X3500X335]  (parts G,H of 23)
R143  49R9  [RESC0603X28N]
R181  49R9  [RESC0603X28N]
R311  330  [RESC1005X40N]
R312  330  [RESC1005X40N]

### Ports
FPGA_CLK (harness FPGA_SDRAM_CLK), MLVDS_FPGA (harness MLVDS-FPGA), SDRAM (harness DDR), SI57X_SEC_OE_C (out), SI57X_SEC_SCL (out), SI57X_SEC_SDA (bidir)

### Harnesses
DDR: CKE0, A0, A1, A2, A3, A4, A5, A7, A8, A9, A10, A11, A12, A13, BA0, BA1, BA2, A14, A15, CAS_N, RAS_N, WE_N, CE0_N, A6, D0, D1, D2, D3, D4, D5, D6, D7, D8, D9, D10, D11, D12, D13, D14, D15, CLK0_N, CLK0_P, ODT0, RST_N, D16, D17, D18, D19, D20, D21, D22, D23, D24, D25, D26, D27, D28, D29, D30, D31, DQS0_P, DQS1_P, DQS0_N, DQS1_N, DQS3_N, DQS3_P, DQS2_P, DQS2_N, DQM0, DQM1, DQM2, DQM3
FPGA_SDRAM_CLK: FPGA_CLK1_N, FPGA_CLK1_P, SI57X_SEC_CLK
MLVDS-FPGA: MLVDS_O_1, MLVDS_O_2, MLVDS_O_3, MLVDS_O_4, MLVDS_O_5, MLVDS_O_6, MLVDS_O_7, MLVDS_O_8, MLVDS_I_1, MLVDS_I_2, MLVDS_I_3, MLVDS_I_4, MLVDS_I_5, MLVDS_I_6, MLVDS_I_7, MLVDS_I_8

### Nets
GND: C134.2 C138.2 C140.2 C141.2 R312.1
VREF: C134.1 C138.1 C140.1 C141.1 IC2.AH8(IO_L19N_T3_VREF_33) IC2.AJ3(IO_L6N_T0_VREF_33) IC2.AK10(IO_L19N_T3_VREF_32) IC2.AL3(IO_L6N_T0_VREF_32)
VTT: R143.2 R181.2
A0: IC2.AP4(IO_L7N_T1_32) ; port SDRAM.A0  [project net FDDR.A0]
A1: IC2.AJ6(IO_L12P_T1_MRCC_32) ; port SDRAM.A1  [project net FDDR.A1]
A2: IC2.AM4(IO_L10N_T1_32) ; port SDRAM.A2  [project net FDDR.A2]
A3: IC2.AM6(IO_L14N_T2_SRCC_32) ; port SDRAM.A3  [project net FDDR.A3]
A4: IC2.AN4(IO_L7P_T1_32) ; port SDRAM.A4  [project net FDDR.A4]
A5: IC2.AK3(IO_L6P_T0_32) ; port SDRAM.A5  [project net FDDR.A5]
A6: IC2.AK5(IO_L8N_T1_32) ; port SDRAM.A6  [project net FDDR.A6]
A7: IC2.AP6(IO_L9P_T1_DQS_32) ; port SDRAM.A7  [project net FDDR.A7]
A8: IC2.AK6(IO_L12N_T1_MRCC_32) ; port SDRAM.A8  [project net FDDR.A8]
A9: IC2.AL4(IO_L10P_T1_32) ; port SDRAM.A9  [project net FDDR.A9]
A10: IC2.AN2(IO_L3N_T0_DQS_32) ; port SDRAM.A10  [project net FDDR.A10]
A11: IC2.AJ8(IO_L15P_T2_DQS_32) ; port SDRAM.A11  [project net FDDR.A11]
A12: IC2.AP5(IO_L9N_T1_DQS_32) ; port SDRAM.A12  [project net FDDR.A12]
A13: IC2.AM7(IO_L14P_T2_SRCC_32) ; port SDRAM.A13  [project net FDDR.A13]
A14: IC2.AK8(IO_L15N_T2_DQS_32) ; port SDRAM.A14  [project net FDDR.A14]
A15: IC2.AP3(IO_L5N_T0_32) ; port SDRAM.A15  [project net FDDR.A15]
BA0: IC2.AM2(IO_L3P_T0_DQS_32) ; port SDRAM.BA0  [project net FDDR.BA0]
BA1: IC2.AK2(IO_L2P_T0_32) ; port SDRAM.BA1  [project net FDDR.BA1]
BA2: IC2.AK1(IO_L2N_T0_32) ; port SDRAM.BA2  [project net FDDR.BA2]
BYTE1_SPARE: IC2.AE6(IO_L13N_T2_MRCC_33)
CAS_N: IC2.AL2(IO_L4P_T0_32) ; port SDRAM.CAS_N  [project net FDDR.CAS_N]
CE0_N: IC2.AN3(IO_L5P_T0_32) ; port SDRAM.CE0_N  [project net FDDR.CE0_N]
CKE0: IC2.AJ5(IO_L8P_T1_32) ; port SDRAM.CKE0  [project net FDDR.CKE0]
CLK0_N: IC2.AM5(IO_L11N_T1_SRCC_32) ; port SDRAM.CLK0_N  [project net FDDR.CLK0_N]
CLK0_P: IC2.AL5(IO_L11P_T1_SRCC_32) ; port SDRAM.CLK0_P  [project net FDDR.CLK0_P]
D0: IC2.AD11(IO_L22P_T3_33) ; port SDRAM.D0  [project net FDDR.D0]
D1: IC2.AE10(IO_L24N_T3_33) ; port SDRAM.D1  [project net FDDR.D1]
D2: IC2.AF12(IO_L20P_T3_33) ; port SDRAM.D2  [project net FDDR.D2]
D3: IC2.AG11(IO_L23P_T3_33) ; port SDRAM.D3  [project net FDDR.D3]
D4: IC2.AE11(IO_L22N_T3_33) ; port SDRAM.D4  [project net FDDR.D4]
D5: IC2.AH11(IO_L23N_T3_33) ; port SDRAM.D5  [project net FDDR.D5]
D6: IC2.AG12(IO_L20N_T3_33) ; port SDRAM.D6  [project net FDDR.D6]
D7: IC2.AH9(IO_L19P_T3_33) ; port SDRAM.D7  [project net FDDR.D7]
D8: IC2.AD6(IO_L13P_T2_MRCC_33) ; port SDRAM.D8  [project net FDDR.D8]
D9: IC2.AG7(IO_L14N_T2_SRCC_33) ; port SDRAM.D9  [project net FDDR.D9]
D10: IC2.AF9(IO_L18P_T2_33) ; port SDRAM.D10  [project net FDDR.D10]
D11: IC2.AH7(IO_L17P_T2_33) ; port SDRAM.D11  [project net FDDR.D11]
D12: IC2.AE8(IO_L16P_T2_33) ; port SDRAM.D12  [project net FDDR.D12]
D13: IC2.AF8(IO_L18N_T2_33) ; port SDRAM.D13  [project net FDDR.D13]
D14: IC2.AE7(IO_L16N_T2_33) ; port SDRAM.D14  [project net FDDR.D14]
D15: IC2.AF7(IO_L14P_T2_SRCC_33) ; port SDRAM.D15  [project net FDDR.D15]
D16: IC2.AF4(IO_L7P_T1_33) ; port SDRAM.D16  [project net FDDR.D16]
D17: IC2.AF5(IO_L12N_T1_MRCC_33) ; port SDRAM.D17  [project net FDDR.D17]
D18: IC2.AD3(IO_L10P_T1_33) ; port SDRAM.D18  [project net FDDR.D18]
D19: IC2.AG5(IO_L11N_T1_SRCC_33) ; port SDRAM.D19  [project net FDDR.D19]
D20: IC2.AD5(IO_L8P_T1_33) ; port SDRAM.D20  [project net FDDR.D20]
D21: IC2.AG6(IO_L11P_T1_SRCC_33) ; port SDRAM.D21  [project net FDDR.D21]
D22: IC2.AD4(IO_L8N_T1_33) ; port SDRAM.D22  [project net FDDR.D22]
D23: IC2.AE3(IO_L10N_T1_33) ; port SDRAM.D23  [project net FDDR.D23]
D24: IC2.AG1(IO_L1P_T0_33) ; port SDRAM.D24  [project net FDDR.D24]
D25: IC2.AG2(IO_L5N_T0_33) ; port SDRAM.D25  [project net FDDR.D25]
D26: IC2.AE1(IO_L2N_T0_33) ; port SDRAM.D26  [project net FDDR.D26]
D27: IC2.AF3(IO_L5P_T0_33) ; port SDRAM.D27  [project net FDDR.D27]
D28: IC2.AE2(IO_L4P_T0_33) ; port SDRAM.D28  [project net FDDR.D28]
D29: IC2.AH3(IO_L6P_T0_33) ; port SDRAM.D29  [project net FDDR.D29]
D30: IC2.AD1(IO_L2P_T0_33) ; port SDRAM.D30  [project net FDDR.D30]
D31: IC2.AF2(IO_L4N_T0_33) ; port SDRAM.D31  [project net FDDR.D31]
DM0: IC2.AD10(IO_L24P_T3_33) ; port SDRAM.DQM0  [project net FDDR.DQM0]
DM1: IC2.AH6(IO_L17N_T2_33) ; port SDRAM.DQM1  [project net FDDR.DQM1]
DM2: IC2.AG4(IO_L7N_T1_33) ; port SDRAM.DQM2  [project net FDDR.DQM2]
DM3: IC2.AH1(IO_L1N_T0_33) ; port SDRAM.DQM3  [project net FDDR.DQM3]
DQS0_N: IC2.AG9(IO_L21N_T3_DQS_33) ; port SDRAM.DQS0_N  [project net FDDR.DQS0_N]
DQS0_P: IC2.AG10(IO_L21P_T3_DQS_33) ; port SDRAM.DQS0_P  [project net FDDR.DQS0_P]
DQS1_N: IC2.AD8(IO_L15N_T2_DQS_33) ; port SDRAM.DQS1_N  [project net FDDR.DQS1_N]
DQS1_P: IC2.AD9(IO_L15P_T2_DQS_33) ; port SDRAM.DQS1_P  [project net FDDR.DQS1_P]
DQS2_N: IC2.AJ4(IO_L9N_T1_DQS_33) ; port SDRAM.DQS2_N  [project net FDDR.DQS2_N]
DQS2_P: IC2.AH4(IO_L9P_T1_DQS_33) ; port SDRAM.DQS2_P  [project net FDDR.DQS2_P]
DQS3_N: IC2.AJ1(IO_L3N_T0_DQS_33) ; port SDRAM.DQS3_N  [project net FDDR.DQS3_N]
DQS3_P: IC2.AH2(IO_L3P_T0_DQS_33) ; port SDRAM.DQS3_P  [project net FDDR.DQS3_P]
FPGA_CLK1_N: IC2.AL7(IO_L13N_T2_MRCC_32) R143.1 ; port FPGA_CLK.FPGA_CLK1_N  [project net FPGA_CLK.FPGA_CLK1_N]
FPGA_CLK1_P: IC2.AK7(IO_L13P_T2_MRCC_32) R181.1 ; port FPGA_CLK.FPGA_CLK1_P  [project net FPGA_CLK.FPGA_CLK1_P]
MLVDS_I_1_C: IC2.AL9(IO_L21P_T3_DQS_32) ; port MLVDS_FPGA.MLVDS_I_1  [project net MLVDS_F.MLVDS_I_1]
MLVDS_I_2_C: IC2.AL8(IO_25_32) ; port MLVDS_FPGA.MLVDS_I_2  [project net MLVDS_F.MLVDS_I_2]
MLVDS_I_3_C: IC2.AP8(IO_L16N_T2_32) ; port MLVDS_FPGA.MLVDS_I_3  [project net MLVDS_F.MLVDS_I_3]
MLVDS_I_4_C: IC2.AM11(IO_L22P_T3_32) ; port MLVDS_FPGA.MLVDS_I_4  [project net MLVDS_F.MLVDS_I_4]
MLVDS_I_5_C: IC2.AL10(IO_L24P_T3_32) ; port MLVDS_FPGA.MLVDS_I_5  [project net MLVDS_F.MLVDS_I_5]
MLVDS_I_6_C: IC2.AK11(IO_L23N_T3_32) ; port MLVDS_FPGA.MLVDS_I_6  [project net MLVDS_F.MLVDS_I_6]
MLVDS_I_7_C: IC2.AJ11(IO_L23P_T3_32) ; port MLVDS_FPGA.MLVDS_I_7  [project net MLVDS_F.MLVDS_I_7]
MLVDS_I_8_C: IC2.AJ10(IO_L19P_T3_32) ; port MLVDS_FPGA.MLVDS_I_8  [project net MLVDS_F.MLVDS_I_8]
MLVDS_O_1_C: IC2.AN8(IO_L16P_T2_32) ; port MLVDS_FPGA.MLVDS_O_1  [project net MLVDS_F.MLVDS_O_1]
MLVDS_O_2_C: IC2.AP9(IO_L18N_T2_32) ; port MLVDS_FPGA.MLVDS_O_2  [project net MLVDS_F.MLVDS_O_2]
MLVDS_O_3_C: IC2.AN9(IO_L18P_T2_32) ; port MLVDS_FPGA.MLVDS_O_3  [project net MLVDS_F.MLVDS_O_3]
MLVDS_O_4_C: IC2.AP10(IO_L20N_T3_32) ; port MLVDS_FPGA.MLVDS_O_4  [project net MLVDS_F.MLVDS_O_4]
MLVDS_O_5_C: IC2.AM9(IO_L21N_T3_DQS_32) ; port MLVDS_FPGA.MLVDS_O_5  [project net MLVDS_F.MLVDS_O_5]
MLVDS_O_6_C: IC2.AP11(IO_L20P_T3_32) ; port MLVDS_FPGA.MLVDS_O_6  [project net MLVDS_F.MLVDS_O_6]
MLVDS_O_7_C: IC2.AN11(IO_L22N_T3_32) ; port MLVDS_FPGA.MLVDS_O_7  [project net MLVDS_F.MLVDS_O_7]
MLVDS_O_8_C: IC2.AM10(IO_L24N_T3_32) ; port MLVDS_FPGA.MLVDS_O_8  [project net MLVDS_F.MLVDS_O_8]
ODT0: IC2.AP1(IO_L1N_T0_32) ; port SDRAM.ODT0  [project net FDDR.ODT0]
RAS_N: IC2.AN1(IO_L1P_T0_32) ; port SDRAM.RAS_N  [project net FDDR.RAS_N]
RST_N: IC2.AJ9(IO_0_32) ; port SDRAM.RST_N  [project net FDDR.RST_N]
SI57X_SEC_CLK: R311.2 ; port FPGA_CLK.SI57X_SEC_CLK  [project net FPGA_CLK.SI57X_SEC_CLK]
SI57X_SEC_OE_C: IC2.AN6(IO_L17N_T2_32) ; port SI57X_SEC_OE_C
SI57X_SEC_SCL: IC2.AN7(IO_L17P_T2_32) ; port SI57X_SEC_SCL
SI57X_SEC_SDA: IC2.AC11(IO_0_33) ; port SI57X_SEC_SDA
WE_N: IC2.AM1(IO_L4N_T0_32) ; port SDRAM.WE_N  [project net FDDR.WE_N]
NetIC2_AE5: IC2.AE5(IO_L12P_T1_MRCC_33) R311.1 R312.2

Not connected (* = marked no-connect by the designer): IC2 AF10(IO_25_33)

### Layout directives
differential pair: FDDR.CLK0_N, FDDR.CLK0_P, FDDR.DQS0_N, FDDR.DQS0_P, FDDR.DQS1_N, FDDR.DQS1_P, FDDR.DQS2_N, FDDR.DQS2_P, FDDR.DQS3_N, FDDR.DQS3_P, FPGA_CLK.FPGA_CLK1_N, FPGA_CLK.FPGA_CLK1_P
net class DDR: A0, A1, A2, A3, A4, A5, A6, A7, A8, A9, A10, A11, A12, A13, A14, A15, BA0, BA1, BA2, CAS_N, CE0_N, CKE0, CLK0_N, CLK0_P, D0, D1, D2, D3, D4, D5, D6, D7, D8, D9, D10, D11, D12, D13, D14, D15, D16, D17, D18, D19, D20, D21, D22, D23, D24, D25, D26, D27, D28, D29, D30, D31, DM0, DM1, DM2, DM3, DQS0_N, DQS0_P, DQS1_N, DQS1_P, DQS2_N, DQS2_P, DQS3_N, DQS3_P, ODT0, RAS_N, RST_N, WE_N
net class DE_SIG: CLK0_N, CLK0_P, DQS0_N, DQS0_P, DQS1_N, DQS1_P, DQS2_N, DQS2_P, DQS3_N, DQS3_P, NetIC2_AE5
net class SE_SIG: A0, A1, A2, A3, A4, A5, A6, A7, A8, A9, A10, A11, A12, A13, A14, A15, BA0, BA1, BA2, CAS_N, CE0_N, CKE0, D0, D1, D2, D3, D4, D5, D6, D7, D8, D9, D10, D11, D12, D13, D14, D15, D16, D17, D18, D19, D20, D21, D22, D23, D24, D25, D26, D27, D28, D29, D30, D31, DM0, DM1, DM2, DM3, ODT0, RAS_N, RST_N, WE_N
net class WDDR_DE: CLK0_N, CLK0_P, DQS0_N, DQS0_P, DQS1_N, DQS1_P, DQS2_N, DQS2_P, DQS3_N, DQS3_P
net class WDDR_SE: A0, A1, A2, A3, A4, A5, A6, A7, A8, A9, A10, A11, A12, A13, A14, A15, BA0, BA1, BA2, CAS_N, CE0_N, CKE0, D0, D1, D2, D3, D4, D5, D6, D7, D8, D9, D10, D11, D12, D13, D14, D15, D16, D17, D18, D19, D20, D21, D22, D23, D24, D25, D26, D27, D28, D29, D30, D31, DM0, DM1, DM2, DM3, ODT0, RAS_N, RST_N, WE_N
differential pair; differential pair class DDR_DIFF: FDDR.CLK0_N, FDDR.CLK0_P, FDDR.DQS0_N, FDDR.DQS0_P, FDDR.DQS1_N, FDDR.DQS1_P, FDDR.DQS2_N, FDDR.DQS2_P, FDDR.DQS3_N, FDDR.DQS3_P
net class SE50: NetIC2_AE5

### Notes on the sheet
- Project/Equipment
- Document
- Designer
- Drawn by
- Check.by
- Copyright CNPEM 2013, WUT ISE 2020
  This documentation describes Open Hardware and is licensed under CERN OHL v.1.1. You may redistribute and modify this documentaction under the terms of the CERN OHL v1.1.
  (http://ohwr.org/CERNOHL). This documentation is dristributed WITHOUT ANY EXPRESS OR IMPLIED WARRANTY, INCLUDING OF MERCHANTABLITY, SATISFACTORY QUALITY AND FITNESS FOR A PARTICULAR PURPOSE. Please see the CERN OHL v.1.1 for applicable conditions
- File
- Last Mod.
- Print Date
- Sheet
- Size
- A3
- of
- Rev
- Contact:
- (in symbol R0201_49R9_1%_0.05W_200PPM) 1%
- (in symbol R0402_330R_1%_0.0625W_100PPM) 1%
- (in symbol XC7A200T-3FFG1156C, part G) BANK 32
- (in symbol XC7A200T-3FFG1156C, part H) BANK 33

### Library data of the parts
C134 C138 C140 C141 = CC0201_100NF_6.3V_10%_X5R: as C88 on sheet FPGA; Part Number: CC0201_100NF_6.3V_10%_X5R; Component Kind: Standard; Component Type: Standard; Pin Count: 2; Value: 100nF; Status: Not Recommended; Manufacturer Part Number: CC0201_100NF_6.3V_10%_X5R; Case: 0201; Mounted: Yes; Socket: No; SMD: Yes; Manufacturer1 Example: AVX; Manufacturer1 ComponentHeight: 0.33mm; HelpURL: \\cern.ch\dfs\Applications\Altium\Datasheets\CC0201_X5R_AVX.pdf; Author: CERN DEM JLC; CreateDate: 2007-12-03; LatestRevisionDate: 2007-12-03
IC2 = XC7A200T-3FFG1156C: as IC2 on sheet FPGA; Part Number: XC7A200T-3FFG1156C; Component Kind: Standard; Component Type: Standard; Device: XC7A200T-3FFG1156C; PackageDescription: BGA, 1.00mm Pitch, Square; 1156 Pin, 34 Columns X 34 Rows, 35.00mm X 35.00mm X 3.350mm H; Pin Count: 1156; Case: BGA1156; Mounted: Yes; Socket: No; SMD: Yes; ComponentHeight: 3.35mm; HelpURL: \\cern.ch\dfs\Applications\Altium\Datasheets\XC7A350T-2FFG1156C.pdf; ComponentLink1URL: \\cern.ch\dfs\Applications\Altium\Datasheets\XC7A350T-2FFG1156C.pdf; ComponentLink1Description: Package/Pinout; Author: CERN DEM JLC; CreateDate: 2012-09-19; LatestRevisionDate: 2012-09-19
R143 R181 = R0201_49R9_1%_0.05W_200PPM: Resistor - 1%; Part Description: Thick Film Chip Resistor; Manufacturer: GENERIC; Manufacturer1 Part Number: CRCW020149R9FNED; Power: 0.05W; TC: ±200ppm/°C; PressFit: No; Part Number: R0201_49R9_1%_0.05W_200PPM; Component Kind: Standard; Component Type: Standard; Pin Count: 2; Value: 49R9; Status: Not Recommended; Tolerance: ±1%; Manufacturer Part Number: R0201_49R9_1%_0.05W_200PPM; Case: 0201; Mounted: Yes; Sense: No; Socket: No; SMD: Yes; Manufacturer1 Example: VISHAY; Manufacturer1 ComponentHeight: 0.27mm; HelpURL: \\cern.ch\dfs\Applications\Altium\Datasheets\R0201_VISHAY_CRCW e3.pdf; Author: CERN DEM BC; CreateDate: 10.01.2020; LatestRevisionDate: 10.01.2020
R311 R312 = R0402_330R_1%_0.0625W_100PPM: as R132 on sheet FPGA; Part Number: R0402_330R_1%_0.0625W_100PPM; Component Kind: Standard; Component Type: Standard; Pin Count: 2; Value: 330; Status: Not recommended; Power: 0.0625W; Tolerance: ±1%; Manufacturer Part Number: R0402_330R_1%_0.0625W_100PPM; Case: 0402; Mounted: Yes; Socket: No; SMD: Yes; Manufacturer1 Example: YAGEO PHYCOMP; Manufacturer1 ComponentHeight: 0.4mm; HelpURL: \\cern.ch\dfs\Applications\Altium\Datasheets\R0402_Phycomp_RC0402.pdf; Author: CERN DEM JLC; CreateDate: 2007-12-03; LatestRevisionDate: 2012-10-17